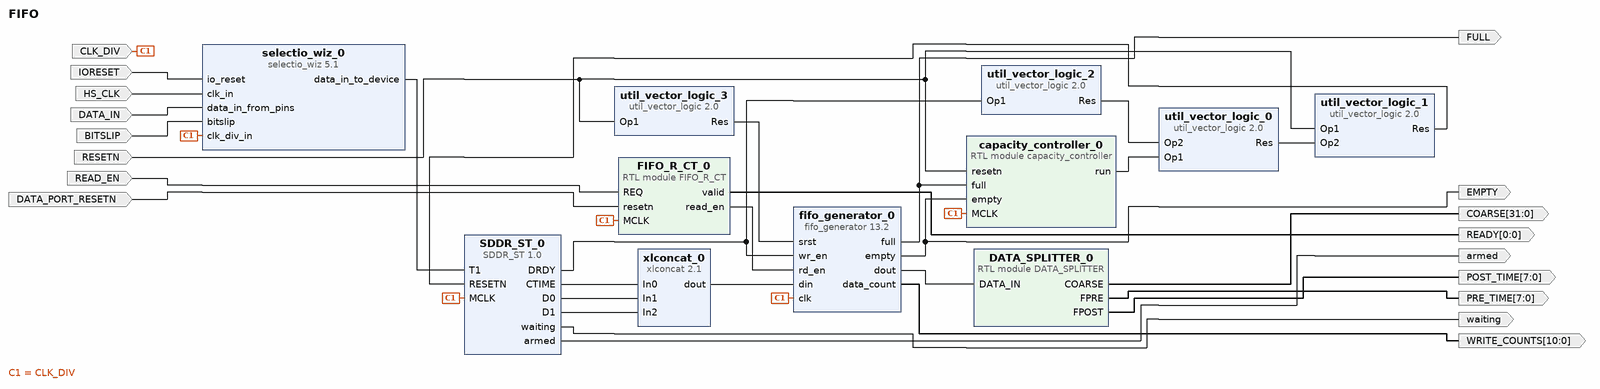
[diagram p0: block diagram of the top level]
# Vivado block design FIFO, xc7z020clg400-1, Vivado 2019.1
create_bd_design FIFO

create_bd_port -dir I -type rst RESETN
create_bd_port -dir I -type rst IORESET
set_property -dict {CONFIG.POLARITY ACTIVE_HIGH} [get_bd_ports IORESET]
create_bd_port -dir I -type clk CLK_DIV
set_property -dict {CONFIG.FREQ_HZ 200000000} [get_bd_ports CLK_DIV]
create_bd_port -dir I -type clk HS_CLK
set_property -dict {CONFIG.FREQ_HZ 800000000} [get_bd_ports HS_CLK]
create_bd_port -dir I -type data DATA_IN
create_bd_port -dir I BITSLIP
create_bd_port -dir O waiting
create_bd_port -dir O armed
create_bd_port -dir O FULL
create_bd_port -dir O EMPTY
create_bd_port -dir O -from 31 -to 0 COARSE
create_bd_port -dir O -from 7 -to 0 PRE_TIME
create_bd_port -dir O -from 7 -to 0 POST_TIME
create_bd_port -dir O -from 0 -to 0 READY
create_bd_port -dir I READ_EN
create_bd_port -dir O -from 10 -to 0 WRITE_COUNTS
create_bd_port -dir I -type rst DATA_PORT_RESETN

create_bd_cell -type ip -vlnv cri.nz:user:SDDR_ST:1.0 SDDR_ST_0
set_property -dict {CONFIG.SIG_WIDTH 8} [get_bd_cells SDDR_ST_0]
create_bd_cell -type ip -vlnv xilinx.com:ip:xlconcat:2.1 xlconcat_0
set_property -dict {CONFIG.IN0_WIDTH 32 CONFIG.IN1_WIDTH 8 CONFIG.IN2_WIDTH 8 CONFIG.NUM_PORTS 3} [get_bd_cells xlconcat_0]
create_bd_cell -type ip -vlnv xilinx.com:ip:util_vector_logic:2.0 util_vector_logic_1
set_property -dict {CONFIG.C_SIZE 1} [get_bd_cells util_vector_logic_1]
create_bd_cell -type ip -vlnv xilinx.com:ip:selectio_wiz:5.1 selectio_wiz_0
set_property -dict [list \
  CONFIG.BUS_IO_STD LVCMOS33 \
  CONFIG.CLK_FWD_IO_STD LVCMOS33 \
  CONFIG.SELIO_ACTIVE_EDGE DDR \
  CONFIG.SELIO_CLK_BUF MMCM \
  CONFIG.SELIO_CLK_IO_STD LVCMOS33 \
  CONFIG.SELIO_INTERFACE_TYPE NETWORKING \
  CONFIG.SERIALIZATION_FACTOR 8 \
  CONFIG.SYSTEM_DATA_WIDTH 1 \
  CONFIG.USE_SERIALIZATION true \
] [get_bd_cells selectio_wiz_0]
create_bd_cell -type ip -vlnv xilinx.com:ip:util_vector_logic:2.0 util_vector_logic_2
set_property -dict {CONFIG.C_OPERATION not CONFIG.C_SIZE 1} [get_bd_cells util_vector_logic_2]
create_bd_cell -type ip -vlnv xilinx.com:ip:util_vector_logic:2.0 util_vector_logic_0
set_property -dict {CONFIG.C_SIZE 1} [get_bd_cells util_vector_logic_0]
create_bd_cell -type module -reference capacity_controller capacity_controller_0
create_bd_cell -type ip -vlnv xilinx.com:ip:util_vector_logic:2.0 util_vector_logic_3
set_property -dict {CONFIG.C_OPERATION not CONFIG.C_SIZE 1} [get_bd_cells util_vector_logic_3]
create_bd_cell -type module -reference DATA_SPLITTER DATA_SPLITTER_0
create_bd_cell -type ip -vlnv xilinx.com:ip:fifo_generator:13.2 fifo_generator_0
set_property -dict [list \
  CONFIG.Data_Count true \
  CONFIG.Data_Count_Width 11 \
  CONFIG.Fifo_Implementation Common_Clock_Block_RAM \
  CONFIG.Input_Data_Width 48 \
  CONFIG.Input_Depth 2048 \
  CONFIG.Output_Data_Width 48 \
  CONFIG.Reset_Pin true \
  CONFIG.Reset_Type Synchronous_Reset \
  CONFIG.Use_Dout_Reset true \
  CONFIG.Valid_Flag true \
  CONFIG.Write_Acknowledge_Flag true \
] [get_bd_cells fifo_generator_0]
create_bd_cell -type module -reference FIFO_R_CT FIFO_R_CT_0

# ---- connections ----

connect_bd_net [get_bd_pins SDDR_ST_0/CTIME] [get_bd_pins xlconcat_0/In0]
connect_bd_net [get_bd_pins SDDR_ST_0/D0] [get_bd_pins xlconcat_0/In1]
connect_bd_net [get_bd_pins SDDR_ST_0/D1] [get_bd_pins xlconcat_0/In2]
connect_bd_net [get_bd_pins util_vector_logic_1/Res] [get_bd_pins SDDR_ST_0/RESETN]
connect_bd_net [get_bd_ports RESETN] \
  [get_bd_pins util_vector_logic_1/Op1] [get_bd_pins capacity_controller_0/resetn] [get_bd_pins util_vector_logic_3/Op1]
connect_bd_net [get_bd_pins selectio_wiz_0/data_in_to_device] [get_bd_pins SDDR_ST_0/T1]
connect_bd_net [get_bd_ports CLK_DIV] \
  [get_bd_pins selectio_wiz_0/clk_div_in] [get_bd_pins SDDR_ST_0/MCLK] [get_bd_pins capacity_controller_0/MCLK] \
  [get_bd_pins fifo_generator_0/clk] [get_bd_pins FIFO_R_CT_0/MCLK]
connect_bd_net [get_bd_ports IORESET] [get_bd_pins selectio_wiz_0/io_reset]
connect_bd_net [get_bd_ports HS_CLK] [get_bd_pins selectio_wiz_0/clk_in]
connect_bd_net [get_bd_ports DATA_IN] [get_bd_pins selectio_wiz_0/data_in_from_pins]
connect_bd_net [get_bd_ports BITSLIP] [get_bd_pins selectio_wiz_0/bitslip]
connect_bd_net [get_bd_pins SDDR_ST_0/waiting] [get_bd_ports waiting]
connect_bd_net [get_bd_pins SDDR_ST_0/armed] [get_bd_ports armed]
connect_bd_net [get_bd_pins fifo_generator_0/full] [get_bd_ports FULL] [get_bd_pins capacity_controller_0/full]
connect_bd_net [get_bd_pins fifo_generator_0/empty] [get_bd_ports EMPTY] [get_bd_pins capacity_controller_0/empty]
connect_bd_net [get_bd_pins util_vector_logic_0/Res] [get_bd_pins util_vector_logic_1/Op2]
connect_bd_net [get_bd_pins util_vector_logic_2/Res] [get_bd_pins util_vector_logic_0/Op2]
connect_bd_net [get_bd_pins capacity_controller_0/run] [get_bd_pins util_vector_logic_0/Op1]
connect_bd_net [get_bd_pins DATA_SPLITTER_0/COARSE] [get_bd_ports COARSE]
connect_bd_net [get_bd_pins DATA_SPLITTER_0/FPRE] [get_bd_ports PRE_TIME]
connect_bd_net [get_bd_pins DATA_SPLITTER_0/FPOST] [get_bd_ports POST_TIME]
connect_bd_net [get_bd_pins SDDR_ST_0/DRDY] [get_bd_pins util_vector_logic_2/Op1] [get_bd_pins fifo_generator_0/wr_en]
connect_bd_net [get_bd_pins xlconcat_0/dout] [get_bd_pins fifo_generator_0/din]
connect_bd_net [get_bd_pins fifo_generator_0/dout] [get_bd_pins DATA_SPLITTER_0/DATA_IN]
connect_bd_net [get_bd_pins fifo_generator_0/data_count] [get_bd_ports WRITE_COUNTS]
connect_bd_net [get_bd_pins FIFO_R_CT_0/read_en] [get_bd_pins fifo_generator_0/rd_en]
connect_bd_net [get_bd_pins util_vector_logic_3/Res] [get_bd_pins fifo_generator_0/srst]
connect_bd_net [get_bd_ports READ_EN] [get_bd_pins FIFO_R_CT_0/REQ]
connect_bd_net [get_bd_ports DATA_PORT_RESETN] [get_bd_pins FIFO_R_CT_0/resetn]
connect_bd_net [get_bd_pins FIFO_R_CT_0/valid] [get_bd_ports READY]

validate_bd_design
save_bd_design
